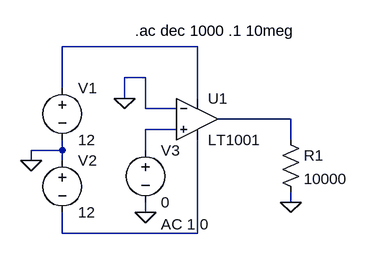
[diagram p0: schematic Draft51.asc]
Draft51.asc, the LTspice schematic file:
Version 4
SHEET 1 880 680
WIRE 128 48 -80 48
WIRE 48 96 16 96
WIRE -80 112 -80 48
WIRE 16 128 16 96
WIRE 128 128 128 48
WIRE 48 144 48 96
WIRE 96 144 48 144
WIRE 272 160 160 160
WIRE 96 176 48 176
WIRE 272 192 272 160
WIRE -80 208 -80 192
WIRE -80 208 -128 208
WIRE 48 208 48 176
WIRE -128 224 -128 208
WIRE -80 224 -80 208
WIRE 272 288 272 272
WIRE 48 304 48 288
WIRE -80 336 -80 304
WIRE 128 336 128 192
WIRE 128 336 -80 336
FLAG -128 224 0
FLAG 16 128 0
FLAG 48 304 0
FLAG 272 288 0
SYMBOL voltage -80 96 R0
WINDOW 123 0 0 Left 2
WINDOW 39 0 0 Left 2
SYMATTR InstName V1
SYMATTR Value 12
SYMBOL voltage -80 208 R0
WINDOW 123 0 0 Left 2
WINDOW 39 0 0 Left 2
SYMATTR InstName V2
SYMATTR Value 12
SYMBOL voltage 48 192 R0
WINDOW 123 24 130 Left 2
WINDOW 39 0 0 Left 2
SYMATTR InstName V3
SYMATTR Value 0
SYMATTR Value2 AC 1 0
SYMBOL res 256 176 R0
SYMATTR InstName R1
SYMATTR Value 10000
SYMBOL Opamps\\LT1001 128 96 R0
SYMATTR InstName U1
TEXT 32 24 Left 2 !.ac dec 1000 .1 10meg

The netlist it stands for:
* Draft51.asc
V1 N001 0 12
V2 0 N004 12
V3 N003 0 0 AC 1 0
R1 N002 0 10000
XU1 N003 0 N001 N004 N002 LT1001  ; pins In+ In- V+ V- OUT
.ac dec 1000 .1 10meg
.lib LTC.lib
.backanno
.end